# EAGLE design atmega32u2 (EAGLE 6.2)
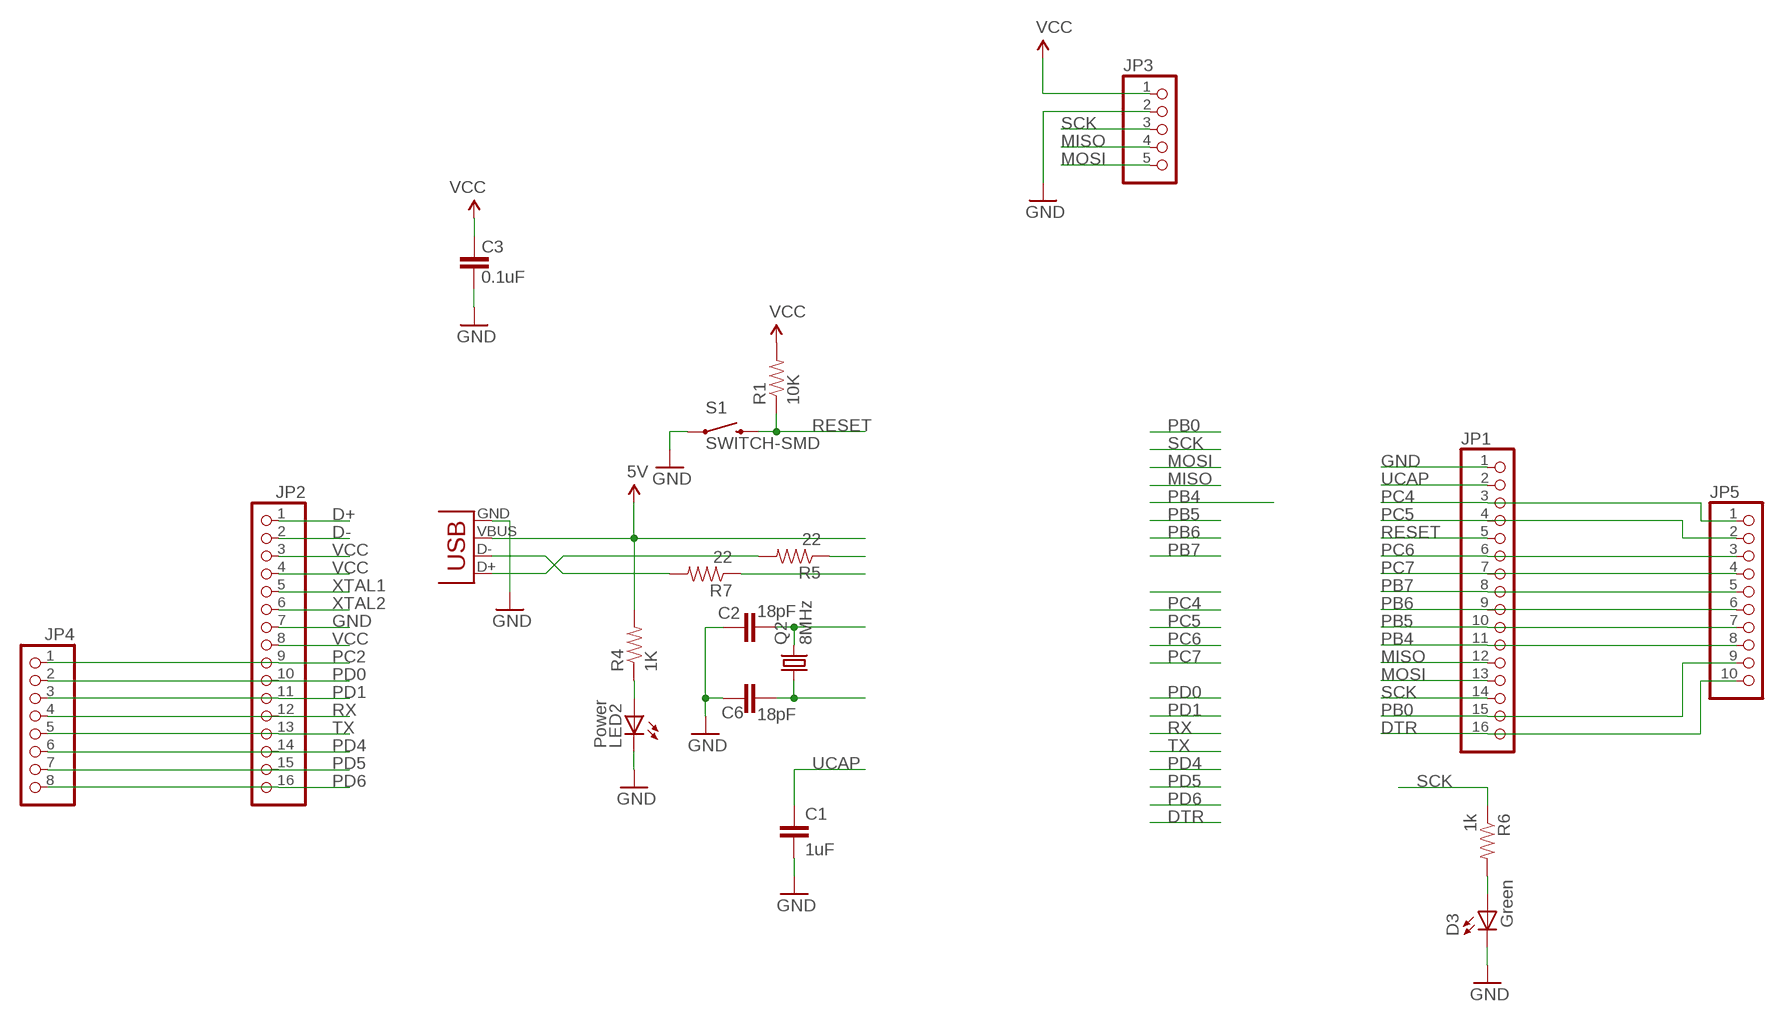
[diagram p0: schematic, sheet 1]

## Parts
C1  1uF  CAP0402-CAP  [0402-CAP]
C2  18pF  CAP0402-CAP  [0402-CAP]
C3  0.1uF  CAP0805  [0805]
C6  18pF  CAP0402-CAP  [0402-CAP]
D3  Green  LED0603  [LED-0603]
JP1  PINHD-1X16  [1X16]
JP2  PINHD-1X16  [1X16]
JP3  PINHD-1X5  [1X05]
JP4  PINHD-1X8  [1X08]
JP5  PINHD-1X10  [1X10]
LED2  Power  LED0603  [LED-0603]
Q2  8MHz  CRYSTALCTS406  [CTS406]
R1  10K  RESISTOR  [0805]
R4  1K  RESISTOR  [0805]
R5  22  RESISTOR  [0805]
R6  1k  RESISTOR  [0805]
R7  22  RESISTOR  [0805]
S1  SWITCH-SMD  SWITCH-MOMENTARY-2SMD  [TACTILE_SWITCH_SMD]
X1  USBSMD  [USB-MINIB]

## Nets
D+: JP2.1 R5.1
D-: JP2.2 R7.1
DTR: JP1.16 JP5.10
GND: C1.2 C2.2 C3.1 C6.2 D3.C JP1.1 JP2.7 JP3.2 LED2.C S1.1 X1.GND
MISO: JP1.12 JP3.4
MOSI: JP1.13 JP3.5
N$2: LED2.A R4.1
N$5: R5.2 X1.D+
N$6: R7.2 X1.D-
N$7: D3.A R6.2
PB0: JP1.15 JP5.9
PB4: JP1.11 JP5.8
PB5: JP1.10 JP5.7
PB6: JP1.9 JP5.6
PB7: JP1.8 JP5.5
PC2: JP2.9 JP4.1
PC4: JP1.3 JP5.1
PC5: JP1.4 JP5.2
PC6: JP1.6 JP5.3
PC7: JP1.7 JP5.4
PD0: JP2.10 JP4.2
PD1: JP2.11 JP4.3
PD4: JP2.14 JP4.6
PD5: JP2.15 JP4.7
PD6: JP2.16 JP4.8
RESET: JP1.5 R1.1 S1.3
RX: JP2.12 JP4.4
SCK: JP1.14 JP3.3 R6.1
TX: JP2.13 JP4.5
UCAP: C1.1 JP1.2
VCC: C3.2 JP2.3 JP2.4 JP2.8 JP3.1 R1.2 R4.2 X1.VBUS ; supply symbol labelled 5V
XTAL1: C2.1 JP2.5 Q2.3
XTAL2: C6.1 JP2.6 Q2.1

## Library data of the parts
C1-C3 C6 = SparkFun:CAP: Capacitor Standard 0603 ceramic capacitor, and 0.1" leaded capacitor.
D3 LED2 = SparkFun:LED: LEDs Standard schematic elements and footprints for 5mm, 3mm, 1206, and 0603 sized LEDs. 5mm - Spark Fun Electronics SKU : COM-00529 (and others)
JP1 JP2 = pinhead:PINHD-1X16: PIN HEADER
JP3 = pinhead:PINHD-1X5: PIN HEADER
JP4 = pinhead:PINHD-1X8: PIN HEADER
JP5 = pinhead:PINHD-1X10: PIN HEADER
Q2 = crystal:CRYSTAL: CRYSTAL; OC_FARNELL: unknown; OC_NEWARK: unknown
R1 R4-R7 = SparkFun:RESISTOR: Resistor Basic schematic elements and footprints for 0603, 1206, and PTH 1/10th watt (small) resistors.
S1 = SparkFun:SWITCH-MOMENTARY-2
X1 = SparkFun:USB: USB Connectors USB-B-PTH is fully proven SKU : PRT-00139 USB-miniB is fully proven SKU : PRT-00587 USB-A-PCB is untested. USB-A-H is throughly reviewed, but untested. Spark Fun Electronics SKU : PRT-00437 USB-B-SMT is throughly reviewed, but untested. Needs silkscreen touching up. USB-A-S has not been used/tested USB-MB-H has not been used/tested

## Net classes
3 usbvcc: width 0.203 mm, drill 0.61 mm, clearance 0.152 mm

## Board
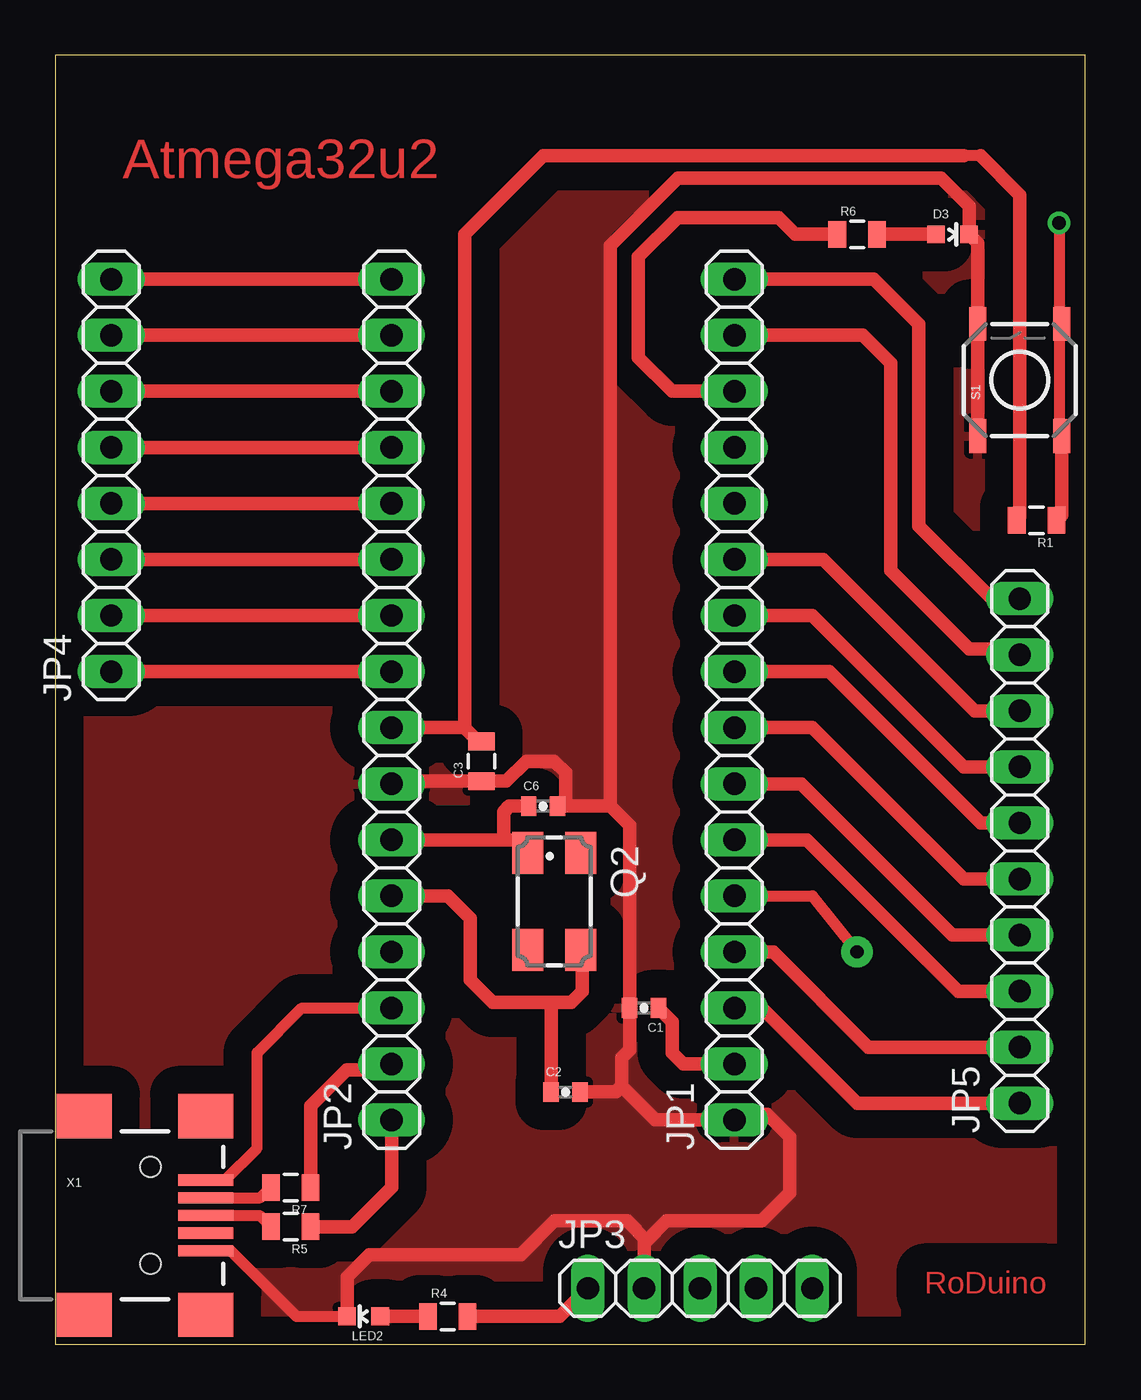
[diagram p1: board, top side]
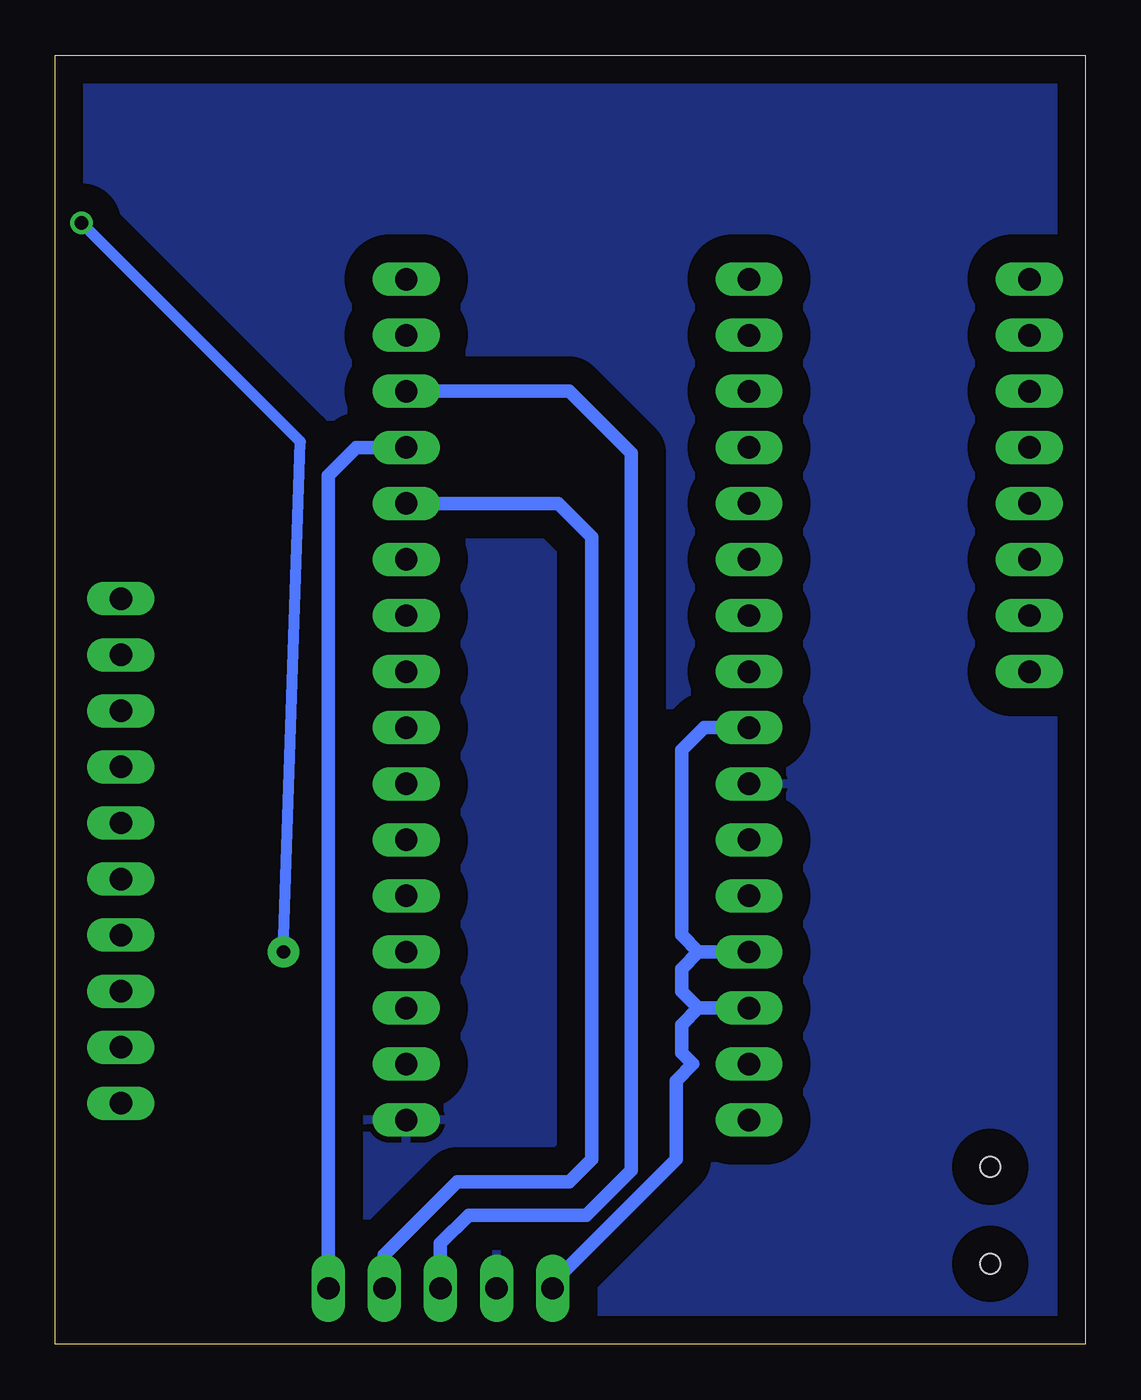
[diagram p2: board, bottom side, seen from below]

Size 46.66 x 58.41 mm. Coordinates in mm from the lower left corner, seen from the top.
Outline: 0,0 46.66,0 46.66,58.41 0,58.41 0,0
Copper layers (1*16): Top 0.035mm / dielectric 1.5mm / Bottom 0.035mm
Design rules: minimum track width 10mil, minimum drill 24mil, track to track 8mil, track to pad 8mil, pad to pad 8mil, via to via 8mil, smd to smd 8mil, copper to edge 40mil, drill to drill 8mil, minimum pad ring 10mil, minimum via ring 8mil, stop-mask expansion 4mil, vias tented up to drill 0mil, thermal gap 10mil

### Footprints (pad centres in the part's own frame; a part is rotated, then mirrored left to right if it is on the bottom)
0402-CAP = smd 0.7 x 0.9: 1 -0.65,0; 2 0.65,0
0805 = smd 0.8 x 1.2: 1 -0.9,0; 2 0.9,0
LED-0603 = smd 0.8 x 0.8: A 0,-0.75; C 0,0.75
1X16 = drill 1.016 long: 1 -19.05,0; 2 -16.51,0; 3 -13.97,0; 4 -11.43,0; 5 -8.89,0; 6 -6.35,0; 7 -3.81,0; 8 -1.27,0; 9 1.27,0; 10 3.81,0; 11 6.35,0; 12 8.89,0; 13 11.43,0; 14 13.97,0; 15 16.51,0; 16 19.05,0
1X05 = drill 1.016 long: 1 -5.08,0; 2 -2.54,0; 3 0,0; 4 2.54,0; 5 5.08,0
1X08 = drill 1.016 long: 1 -8.89,0; 2 -6.35,0; 3 -3.81,0; 4 -1.27,0; 5 1.27,0; 6 3.81,0; 7 6.35,0; 8 8.89,0
1X10 = drill 1.016 long: 1 -11.43,0; 2 -8.89,0; 3 -6.35,0; 4 -3.81,0; 5 -1.27,0; 6 1.27,0; 7 3.81,0; 8 6.35,0; 9 8.89,0; 10 11.43,0
CTS406 = smd 1.9 x 1.4: 1 -2.2,-1.2; 2 2.2,-1.2; 3 2.2,1.2; 4 -2.2,1.2
TACTILE_SWITCH_SMD = smd 1.524 x 0.762: 1 -2.54,1.905; 2 2.54,1.905; 3 -2.54,-1.905; 4 2.54,-1.905
USB-MINIB = smd 2.5 x 0.5: D+ 2.5,0; D- 2.5,0.8; GND 2.5,-1.6; ID 2.5,-0.8; VBUS 2.5,1.6 | smd 2.5 x 2: MTN1 -3,4.5; MTN2 2.5,4.5; MTN3 -3,-4.5; MTN4 2.5,-4.5 | hole 0.9: 0,2.2; 0,-2.2

### Placement (x,y rotation side)
C1  26.67,15.24 180 top
C2  23.11,11.43 0 top
C3  19.3,26.42 90 top
C6  22.1,24.38 0 top
D3  40.64,50.29 270 top
JP1  30.76,29.21 90 top
JP2  15.24,29.21 90 top
JP3  29.21,2.54 0 top
JP4  2.54,39.37 90 top
JP5  43.69,22.35 90 top
LED2  13.97,1.27 90 top
Q2  22.61,20.07 270 top
R1  44.45,37.34 180 top
R4  17.78,1.27 0 top
R5  10.67,5.33 180 top
R6  36.32,50.29 0 top
R7  10.67,7.11 180 top
S1  43.69,43.69 90 top
X1  4.32,5.84 0 top

### Tracks (layer width: path | path; a pad name or v marks a point on that pad's centre or on a via)
D+
  Top 0.61: R5.1 13.46,5.33 15.24,7.11 JP2.1
D-
  Top 0.61: R7.1 11.57,10.81 13.21,12.45 14.99,12.45 JP2.2
DTR
  Top 0.61: JP5.10 42.42,33.78 39.12,37.08 39.12,46.23 37.08,48.26 JP1.16
GND
  Top 0.508: X1.GND 7.95,4.24 10.92,1.27 LED2.C
  Top 0.61: C2.2 25.4,11.43 25.65,11.68 | 25.15,24.38 26.02,23.51 C1.2 26.02,13.35 25.65,12.98 25.65,11.68 | 25.15,24.38 C6.2 23.11,24.75 23.11,25.91 22.61,26.42 21.34,26.42 20.44,25.52 C3.1 15.36,25.52 JP2.7 | JP3.2 26.67,4.57 26.8,4.7 | 26.8,4.7 27.69,5.59 32,5.59 33.27,6.86 33.27,9.4 32.26,10.41 31.01,10.41 JP1.1 27.18,10.16 25.65,11.68 | LED2.C 13.22,3.06 14.22,4.06 21.08,4.06 22.61,5.59 25.91,5.59 26.8,4.7 | S1.1 41.78,49.9 D3.C 41.4,50.3 41.4,51.56 40.13,52.83 28.19,52.83 25.15,49.78 25.15,24.38
  pour Bottom (isolate 1.27): 46.48,58.17 46.48,0 0.25,0 0.25,58.17
  pour Top (isolate 1.27): 0.25,58.17 46.48,58.17 46.48,0 0.25,0
MISO
  Bottom 0.61: JP3.4 31.75,4.06 28.45,7.37 23.37,7.37 22.35,8.38 22.35,36.58 23.88,38.1 JP1.12
MOSI
  Bottom 0.61: JP3.5 34.29,39.37 33.02,40.64 JP1.13
N$2
  Top 0.61: R4.1 LED2.A
N$5
  Top 0.508: X1.D+ 9.26,5.84 R5.2
N$6
  Top 0.508: X1.D- 9.3,6.64 R7.2
N$7
  Top 0.61: R6.2 D3.A
PB0
  Top 0.61: JP1.15 36.58,45.72 37.85,44.45 37.85,35.05 41.4,31.5 43.43,31.5 JP5.9
PB4
  Top 0.61: JP5.8 41.66,28.7 34.8,35.56 JP1.11
PB5
  Top 0.61: JP1.10 34.29,33.02 41.15,26.16 JP5.7
PB6
  Top 0.61: JP5.6 41.91,23.62 35.05,30.48 JP1.9
PB7
  Top 0.61: JP1.8 34.29,27.94 41.15,21.08 JP5.5
PC2
  Top 0.61: JP2.9 JP4.1
PC4
  Top 0.61: JP5.1 38.86,10.92 36.32,10.92 32,15.24 JP1.3
PC5
  Top 0.61: 39.37,13.46 39.88,13.46 | 39.88,13.46 JP5.2 | JP1.4 32.51,17.78 36.83,13.46 39.88,13.46
PC6
  Top 0.61: JP5.3 40.89,16 34.04,22.86 JP1.6
PC7
  Top 0.61: JP1.7 33.78,25.4 40.64,18.54 JP5.4
PD0
  Top 0.61: JP4.2 JP2.10
PD1
  Top 0.61: JP4.3 JP2.11
PD4
  Top 0.61: JP2.14 JP4.6
PD5
  Top 0.61: JP4.7 JP2.15
PD6
  Top 0.61: JP2.16 JP4.8
RESET  (via drill 0.61, 0.61 pad 1.42)
  Top 0.508: JP1.5 34.29,20.32 v36.32,17.78 | v45.47,50.8 45.47,41.27 S1.3
  Top 0.61: S1.3 45.59,37.58 R1.1
  Bottom 0.508: v36.32,17.78 35.56,40.89 v45.47,50.8
RX
  Top 0.61: JP2.12 JP4.4
SCK
  Top 0.61: JP1.14 27.94,43.18 26.42,44.7 26.42,49.28 28.19,51.05 32.77,51.05 33.53,50.29 R6.1
  Bottom 0.61: JP3.3 29.21,4.57 27.94,5.84 22.61,5.84 20.57,7.87 20.57,40.39 23.37,43.18 JP1.14
TX
  Top 0.61: JP4.5 JP2.13
UCAP
  Top 0.61: JP1.2 28.45,12.7 27.94,13.21 27.94,14.62 C1.1
VCC
  Top 0.508: X1.VBUS 7.7,7.44 9.14,8.89 9.14,13.21 11.18,15.24 JP2.3 | 41.91,53.85 41.15,53.85
  Top 0.61: R4.2 22.86,1.27 JP3.1 | C3.2 19.17,27.32 18.67,27.81 | 18.67,27.81 18.54,27.94 | 18.54,27.94 JP2.8 | 41.15,53.85 22.1,53.85 18.54,50.29 18.54,27.94 | 18.54,27.94 18.67,27.81 | 41.91,53.85 43.69,52.07 43.69,37.48 R1.2
  Bottom 0.61: JP3.1 24.13,2.79 18.54,8.38 18.54,11.94 17.78,12.7 18.29,13.21 18.29,14.48 17.53,15.24 | 17.53,15.24 18.29,16 18.29,17.02 17.53,17.78 | 17.53,17.78 JP2.4 | JP2.8 17.27,27.94 18.29,26.92 18.29,18.54 17.53,17.78 | 17.53,15.24 JP2.3
XTAL1
  Top 0.61: JP2.5 17.78,20.32 18.8,19.3 18.8,16.51 19.81,15.49 22.35,15.49 | 22.35,15.49 23.37,15.49 23.88,16 23.88,17.8 Q2.3 | C2.1 22.46,15.38 22.35,15.49
XTAL2
  Top 0.61: JP2.6 20.32,22.86 | 20.32,22.86 20.81,22.86 Q2.1 | C6.1 20.57,24.38 20.32,24.13 20.32,22.86

### Text on the board
Top: Atmega32u2 | RoDuino